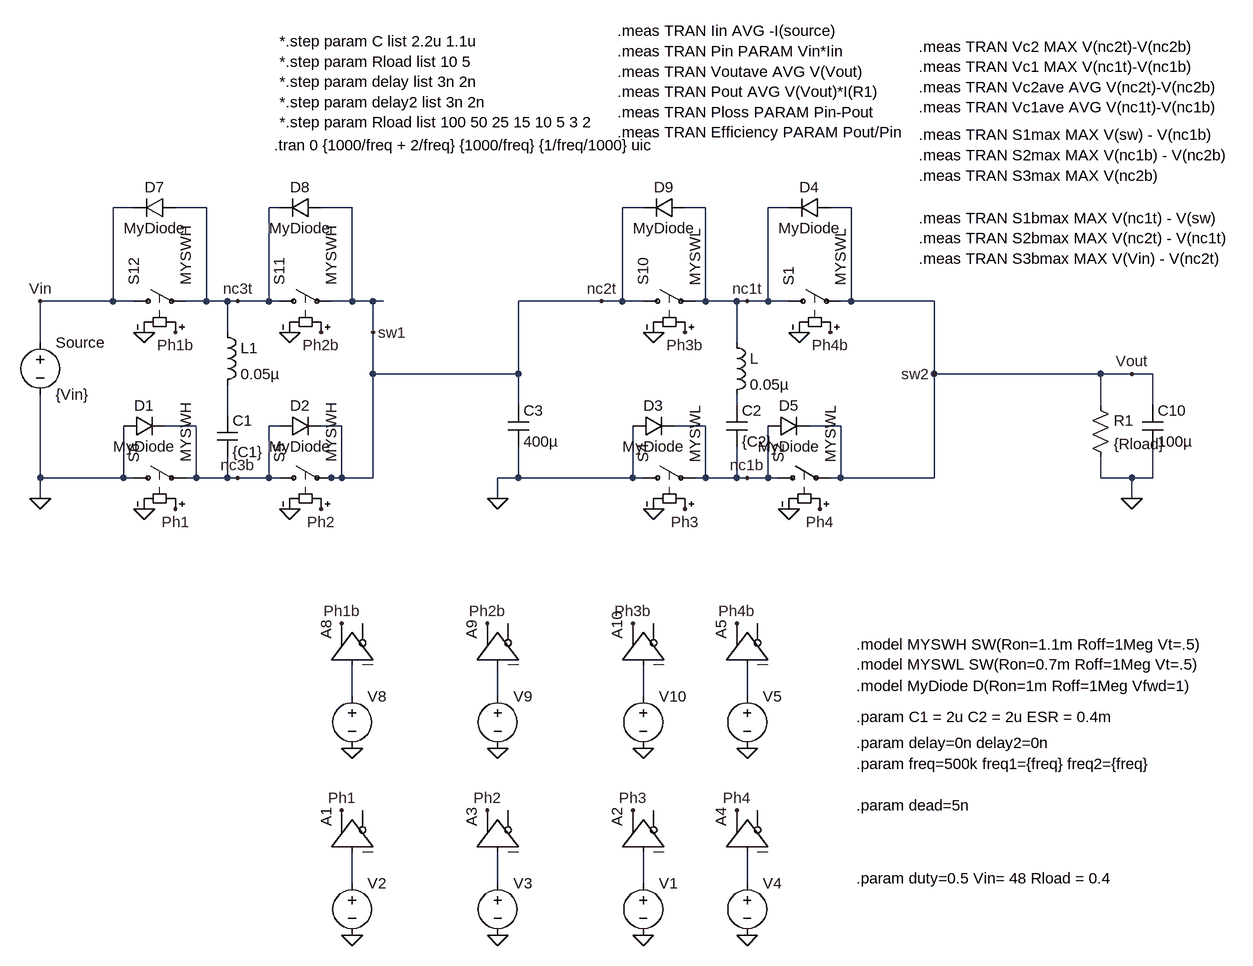
[diagram p0: schematic 3level_squared_48V_distributed_1.asc]
3level_squared_48V_distributed_1.asc, the LTspice schematic file:
Version 4
SHEET 1 1904 1716
WIRE -1472 -64 -1504 -64
WIRE -1360 -64 -1408 -64
WIRE -1248 -64 -1264 -64
WIRE -1136 -64 -1184 -64
WIRE -688 -64 -720 -64
WIRE -592 -64 -624 -64
WIRE -464 -64 -496 -64
WIRE -368 -64 -400 -64
WIRE -1504 80 -1504 -64
WIRE -1504 80 -1616 80
WIRE -1472 80 -1504 80
WIRE -1360 80 -1360 -64
WIRE -1360 80 -1392 80
WIRE -1328 80 -1360 80
WIRE -1312 80 -1328 80
WIRE -1264 80 -1264 -64
WIRE -1264 80 -1312 80
WIRE -1248 80 -1264 80
WIRE -1136 80 -1136 -64
WIRE -1136 80 -1168 80
WIRE -1104 80 -1136 80
WIRE -1088 80 -1104 80
WIRE -752 80 -880 80
WIRE -720 80 -720 -64
WIRE -720 80 -752 80
WIRE -688 80 -720 80
WIRE -592 80 -592 -64
WIRE -592 80 -608 80
WIRE -544 80 -592 80
WIRE -528 80 -544 80
WIRE -496 80 -496 -64
WIRE -496 80 -528 80
WIRE -464 80 -496 80
WIRE -368 80 -368 -64
WIRE -368 80 -384 80
WIRE -240 80 -368 80
WIRE -1328 128 -1328 80
WIRE -1104 128 -1104 80
WIRE -1616 144 -1616 80
WIRE -544 144 -544 80
WIRE -1104 192 -1104 128
WIRE -880 192 -880 80
WIRE -880 192 -1104 192
WIRE -240 192 -240 80
WIRE 16 192 -240 192
WIRE 64 192 16 192
WIRE 96 192 64 192
WIRE -880 240 -880 192
WIRE -544 240 -544 224
WIRE 16 240 16 192
WIRE 96 240 96 192
WIRE -1328 256 -1328 208
WIRE -1376 272 -1424 272
WIRE -1248 272 -1264 272
WIRE -1152 272 -1184 272
WIRE -592 272 -640 272
WIRE -384 272 -432 272
WIRE -1616 352 -1616 224
WIRE -1488 352 -1488 272
WIRE -1488 352 -1616 352
WIRE -1472 352 -1488 352
WIRE -1376 352 -1376 272
WIRE -1376 352 -1392 352
WIRE -1328 352 -1328 320
WIRE -1328 352 -1376 352
WIRE -1312 352 -1328 352
WIRE -1264 352 -1264 272
WIRE -1264 352 -1312 352
WIRE -1248 352 -1264 352
WIRE -1168 352 -1184 352
WIRE -1152 352 -1152 272
WIRE -1152 352 -1168 352
WIRE -1104 352 -1104 192
WIRE -1104 352 -1152 352
WIRE -880 352 -880 304
WIRE -880 352 -912 352
WIRE -704 352 -704 272
WIRE -704 352 -880 352
WIRE -688 352 -704 352
WIRE -592 352 -592 272
WIRE -592 352 -608 352
WIRE -544 352 -544 304
WIRE -544 352 -592 352
WIRE -528 352 -544 352
WIRE -496 352 -496 272
WIRE -496 352 -528 352
WIRE -480 352 -496 352
WIRE -384 352 -384 272
WIRE -384 352 -400 352
WIRE -240 352 -240 192
WIRE -240 352 -384 352
WIRE 16 352 16 320
WIRE 64 352 16 352
WIRE 96 352 96 304
WIRE 96 352 64 352
WIRE -1616 384 -1616 352
WIRE -912 384 -912 352
WIRE 64 384 64 352
WIRE -1136 688 -1136 640
WIRE -912 688 -912 640
WIRE -688 688 -688 640
WIRE -528 688 -528 640
WIRE -1136 976 -1136 928
WIRE -912 976 -912 928
WIRE -688 976 -688 928
WIRE -528 976 -528 928
FLAG -1136 1056 0
FLAG -1152 864 Ph1
FLAG -1616 80 Vin
FLAG -624 128 Ph3b
FLAG -1184 128 Ph2b
FLAG -1408 128 Ph1b
FLAG -1456 128 0
FLAG -1232 128 0
FLAG -672 128 0
FLAG -912 1056 0
FLAG -928 864 Ph2
FLAG -624 400 Ph3
FLAG -1184 400 Ph2
FLAG -1408 400 Ph1
FLAG -1456 400 0
FLAG -1232 400 0
FLAG -672 400 0
FLAG 64 384 0
FLAG -1616 384 0
FLAG -688 1056 0
FLAG -704 864 Ph3
FLAG -1136 768 0
FLAG -1152 576 Ph1b
FLAG -912 768 0
FLAG -928 576 Ph2b
FLAG -688 768 0
FLAG -704 576 Ph3b
FLAG -1312 80 nc3t
FLAG -752 80 nc2t
FLAG -1312 352 nc3b
FLAG -240 192 sw2
FLAG -400 128 Ph4b
FLAG -448 128 0
FLAG -416 400 Ph4
FLAG -464 400 0
FLAG -528 80 nc1t
FLAG -528 352 nc1b
FLAG -528 1056 0
FLAG -544 864 Ph4
FLAG -528 768 0
FLAG -544 576 Ph4b
FLAG 64 192 Vout
FLAG -912 384 0
FLAG -1104 128 sw1
SYMBOL voltage -1136 960 R0
WINDOW 123 0 0 Left 2
WINDOW 39 0 0 Left 2
WINDOW 3 24 96 Invisible 2
SYMATTR Value PULSE(0 1 0 1p 1p {1/freq1*(1-duty)} {1/freq1})
SYMATTR InstName V2
SYMBOL Digital\\buf -1200 928 R270
SYMATTR InstName A1
SYMBOL voltage -1616 128 R0
WINDOW 123 0 0 Left 2
WINDOW 39 0 0 Left 2
SYMATTR InstName Source
SYMATTR Value {Vin}
SYMBOL sw -704 80 R270
SYMATTR InstName S10
SYMATTR Value MYSWL
SYMBOL sw -1264 80 R270
SYMATTR InstName S11
SYMATTR Value MYSWH
SYMBOL sw -1488 80 R270
SYMATTR InstName S12
SYMATTR Value MYSWH
SYMBOL voltage -912 960 R0
WINDOW 123 0 0 Left 2
WINDOW 39 0 0 Left 2
WINDOW 3 24 96 Invisible 2
SYMATTR Value PULSE(0 1 {1/freq1/2+delay} 1p 1p {1/freq1*(1-duty)-delay+delay2} {1/freq1})
SYMATTR InstName V3
SYMBOL Digital\\buf -976 928 R270
SYMATTR InstName A3
SYMBOL sw -704 352 R270
SYMATTR InstName S4
SYMATTR Value MYSWL
SYMBOL sw -1264 352 R270
SYMATTR InstName S5
SYMATTR Value MYSWH
SYMBOL sw -1488 352 R270
SYMATTR InstName S6
SYMATTR Value MYSWH
SYMBOL cap -1344 256 R0
SYMATTR InstName C1
SYMATTR Value {C1}
SYMATTR SpiceLine Rser={ESR}
SYMATTR SpiceLine2 IC={Vin/2}
SYMBOL ind -560 128 R0
SYMATTR InstName L
SYMATTR Value 0.05µ
SYMATTR SpiceLine Rser=0.2m Rpar=1k
SYMATTR SpiceLine2 ic = {Vin*duty/Rload}
SYMBOL res 0 224 R0
SYMATTR InstName R1
SYMATTR Value {Rload}
SYMBOL cap 80 240 R0
SYMATTR InstName C10
SYMATTR Value 100µ
SYMATTR SpiceLine IC={Vin*duty}
SYMATTR SpiceLine2 Rser={ESR}
SYMBOL voltage -688 960 R0
WINDOW 123 0 0 Left 2
WINDOW 39 0 0 Left 2
WINDOW 3 24 96 Invisible 2
SYMATTR Value PULSE(0 1 0 1p 1p {1/freq2*(1-duty)} {1/freq2})
SYMATTR InstName V1
SYMBOL Digital\\buf -752 928 R270
SYMATTR InstName A2
SYMBOL voltage -1136 672 R0
WINDOW 123 0 0 Left 2
WINDOW 39 0 0 Left 2
WINDOW 3 24 96 Invisible 2
SYMATTR Value PULSE(0 1 {1/freq1*(1-duty)+dead+delay} 1p 1p {1/freq1*duty-dead*2-delay+delay2} {1/freq1})
SYMATTR InstName V8
SYMBOL Digital\\buf -1200 640 R270
SYMATTR InstName A8
SYMBOL voltage -912 672 R0
WINDOW 123 0 0 Left 2
WINDOW 39 0 0 Left 2
WINDOW 3 24 96 Invisible 2
SYMATTR Value PULSE(0 1 {1/freq1/2+1/freq1*(1-duty)+dead} 1p 1p {1/freq1*duty-dead*2} {1/freq1})
SYMATTR InstName V9
SYMBOL Digital\\buf -976 640 R270
SYMATTR InstName A9
SYMBOL voltage -688 672 R0
WINDOW 123 0 0 Left 2
WINDOW 39 0 0 Left 2
WINDOW 3 24 44 Invisible 2
SYMATTR Value PULSE(0 1 {1/freq2*(1-duty)+dead+delay} 1p 1p {1/freq2*duty-dead*2-delay+delay2} {1/freq2})
SYMATTR InstName V10
SYMBOL Digital\\buf -752 640 R270
SYMATTR InstName A10
SYMBOL diode -1488 288 R270
WINDOW 0 32 32 VTop 2
WINDOW 3 0 32 VBottom 2
SYMATTR InstName D1
SYMATTR Value MyDiode
SYMBOL diode -1248 288 R270
WINDOW 0 32 32 VTop 2
WINDOW 3 0 32 VBottom 2
SYMATTR InstName D2
SYMATTR Value MyDiode
SYMBOL diode -704 288 R270
WINDOW 0 32 32 VTop 2
WINDOW 3 0 32 VBottom 2
SYMATTR InstName D3
SYMATTR Value MyDiode
SYMBOL diode -1408 -80 R90
WINDOW 0 0 32 VBottom 2
WINDOW 3 32 32 VTop 2
SYMATTR InstName D7
SYMATTR Value MyDiode
SYMBOL diode -1184 -80 R90
WINDOW 0 0 32 VBottom 2
WINDOW 3 32 32 VTop 2
SYMATTR InstName D8
SYMATTR Value MyDiode
SYMBOL diode -624 -80 R90
WINDOW 0 0 32 VBottom 2
WINDOW 3 32 32 VTop 2
SYMATTR InstName D9
SYMATTR Value MyDiode
SYMBOL sw -480 80 R270
SYMATTR InstName S1
SYMATTR Value MYSWL
SYMBOL diode -400 -80 R90
WINDOW 0 0 32 VBottom 2
WINDOW 3 32 32 VTop 2
SYMATTR InstName D4
SYMATTR Value MyDiode
SYMBOL sw -496 352 R270
SYMATTR InstName S2
SYMATTR Value MYSWL
SYMBOL diode -496 288 R270
WINDOW 0 32 32 VTop 2
WINDOW 3 0 32 VBottom 2
SYMATTR InstName D5
SYMATTR Value MyDiode
SYMBOL cap -560 240 R0
SYMATTR InstName C2
SYMATTR Value {C2}
SYMATTR SpiceLine Rser={ESR}
SYMATTR SpiceLine2 IC={Vin/4}
SYMBOL voltage -528 960 R0
WINDOW 123 0 0 Left 2
WINDOW 39 0 0 Left 2
WINDOW 3 24 96 Invisible 2
SYMATTR Value PULSE(0 1 {1/freq2/2} 1p 1p {1/freq2*(1-duty)} {1/freq2})
SYMATTR InstName V4
SYMBOL Digital\\buf -592 928 R270
SYMATTR InstName A4
SYMBOL voltage -528 672 R0
WINDOW 123 0 0 Left 2
WINDOW 39 0 0 Left 2
WINDOW 3 24 44 Invisible 2
SYMATTR Value PULSE(0 1 {1/freq2/2+1/freq2*(1-duty)+dead+delay} 1p 1p {1/freq2*duty-dead*2-delay+delay2} {1/freq2})
SYMATTR InstName V5
SYMBOL Digital\\buf -592 640 R270
SYMATTR InstName A5
SYMBOL ind -1344 112 R0
SYMATTR InstName L1
SYMATTR Value 0.05µ
SYMATTR SpiceLine Rser=0.2m Rpar=1k
SYMATTR SpiceLine2 ic = {Vin*duty/Rload}
SYMBOL cap -896 240 R0
SYMATTR InstName C3
SYMATTR Value 400µ
SYMATTR SpiceLine IC={Vin/2}
SYMATTR SpiceLine2 Rser={ESR}
TEXT -1256 -160 Left 2 !.tran 0 {1000/freq + 2/freq} {1000/freq} {1/freq/1000} uic
TEXT -360 608 Left 2 !.model MYSWH SW(Ron=1.1m Roff=1Meg Vt=.5)\n.model MYSWL SW(Ron=0.7m Roff=1Meg Vt=.5)
TEXT -360 672 Left 2 !.model MyDiode D(Ron=1m Roff=1Meg Vfwd=1)
TEXT -360 760 Left 2 !.param delay=0n delay2=0n
TEXT -360 792 Left 2 !.param freq=500k freq1={freq} freq2={freq}
TEXT -360 968 Left 2 !.param duty=0.5 Vin= 48 Rload = 0.4
TEXT -360 856 Left 2 !.param dead=5n
TEXT -360 720 Left 2 !.param C1 = 2u C2 = 2u ESR = 0.4m
TEXT -264 -176 Left 2 !.meas TRAN S1max MAX V(sw) - V(nc1b)\n.meas TRAN S2max MAX V(nc1b) - V(nc2b)\n.meas TRAN S3max MAX V(nc2b)
TEXT -264 -312 Left 2 !.meas TRAN Vc2 MAX V(nc2t)-V(nc2b)\n.meas TRAN Vc1 MAX V(nc1t)-V(nc1b)\n.meas TRAN Vc2ave AVG V(nc2t)-V(nc2b)\n.meas TRAN Vc1ave AVG V(nc1t)-V(nc1b)
TEXT -264 -48 Left 2 !.meas TRAN S1bmax MAX V(nc1t) - V(sw) \n.meas TRAN S2bmax MAX V(nc2t) - V(nc1t) \n.meas TRAN S3bmax MAX V(Vin) - V(nc2t)
TEXT -1248 -320 Left 2 !*.step param C list 2.2u 1.1u\n*.step param Rload list 10 5\n*.step param delay list 3n 2n\n*.step param delay2 list 3n 2n\n*.step param Rload list 100 50 25 15 10 5 3 2
TEXT -728 -336 Left 2 !.meas TRAN Iin AVG -I(source)\n.meas TRAN Pin PARAM Vin*Iin\n.meas TRAN Voutave AVG V(Vout)\n.meas TRAN Pout AVG V(Vout)*I(R1)\n.meas TRAN Ploss PARAM Pin-Pout\n.meas TRAN Efficiency PARAM Pout/Pin

The netlist it stands for:
* 3level_squared_48V_distributed_1.asc
V2 N007 0 PULSE(0 1 0 1p 1p {1/freq1*(1-duty)} {1/freq1})
A1 N007 0 0 0 0 0 Ph1 0 BUF
V§Source Vin 0 {Vin}
S10 sw1 nc1t Ph3b 0 MYSWL
S11 nc3t sw1 Ph2b 0 MYSWH
S12 Vin nc3t Ph1b 0 MYSWH
V3 N008 0 PULSE(0 1 {1/freq1/2+delay} 1p 1p {1/freq1*(1-duty)-delay+delay2} {1/freq1})
A3 N008 0 0 0 0 0 Ph2 0 BUF
S4 0 nc1b Ph3 0 MYSWL
S5 nc3b sw1 Ph2 0 MYSWH
S6 0 nc3b Ph1 0 MYSWH
C1 N002 nc3b {C1} Rser={ESR} IC={Vin/2}
L nc1t N001 0.05µ Rser=0.2m Rpar=1k ic = {Vin*duty/Rload}
R1 Vout 0 {Rload}
C10 Vout 0 100µ IC={Vin*duty} Rser={ESR}
V1 N009 0 PULSE(0 1 0 1p 1p {1/freq2*(1-duty)} {1/freq2})
A2 N009 0 0 0 0 0 Ph3 0 BUF
V8 N003 0 PULSE(0 1 {1/freq1*(1-duty)+dead+delay} 1p 1p {1/freq1*duty-dead*2-delay+delay2} {1/freq1})
A8 N003 0 0 0 0 0 Ph1b 0 BUF
V9 N004 0 PULSE(0 1 {1/freq1/2+1/freq1*(1-duty)+dead} 1p 1p {1/freq1*duty-dead*2} {1/freq1})
A9 N004 0 0 0 0 0 Ph2b 0 BUF
V10 N005 0 PULSE(0 1 {1/freq2*(1-duty)+dead+delay} 1p 1p {1/freq2*duty-dead*2-delay+delay2} {1/freq2})
A10 N005 0 0 0 0 0 Ph3b 0 BUF
D1 0 nc3b MyDiode
D2 nc3b sw1 MyDiode
D3 0 nc1b MyDiode
D7 nc3t Vin MyDiode
D8 sw1 nc3t MyDiode
D9 nc1t sw1 MyDiode
S1 nc1t Vout Ph4b 0 MYSWL
D4 Vout nc1t MyDiode
S2 nc1b Vout Ph4 0 MYSWL
D5 nc1b Vout MyDiode
C2 N001 nc1b {C2} Rser={ESR} IC={Vin/4}
V4 N010 0 PULSE(0 1 {1/freq2/2} 1p 1p {1/freq2*(1-duty)} {1/freq2})
A4 N010 0 0 0 0 0 Ph4 0 BUF
V5 N006 0 PULSE(0 1 {1/freq2/2+1/freq2*(1-duty)+dead+delay} 1p 1p {1/freq2*duty-dead*2-delay+delay2} {1/freq2})
A5 N006 0 0 0 0 0 Ph4b 0 BUF
L1 nc3t N002 0.05µ Rser=0.2m Rpar=1k ic = {Vin*duty/Rload}
C3 sw1 0 400µ IC={Vin/2} Rser={ESR}
.model D D
.lib standard.dio
.tran 0 {1000/freq + 2/freq} {1000/freq} {1/freq/1000} uic
.model MYSWH SW(Ron=1.1m Roff=1Meg Vt=.5)
.model MYSWL SW(Ron=0.7m Roff=1Meg Vt=.5)
.model MyDiode D(Ron=1m Roff=1Meg Vfwd=1)
.param delay=0n delay2=0n
.param freq=500k freq1={freq} freq2={freq}
.param duty=0.5 Vin= 48 Rload = 0.4
.param dead=5n
.param C1 = 2u C2 = 2u ESR = 0.4m
.meas TRAN S1max MAX V(sw) - V(nc1b)
.meas TRAN S2max MAX V(nc1b) - V(nc2b)
.meas TRAN S3max MAX V(nc2b)
.meas TRAN Vc2 MAX V(nc2t)-V(nc2b)
.meas TRAN Vc1 MAX V(nc1t)-V(nc1b)
.meas TRAN Vc2ave AVG V(nc2t)-V(nc2b)
.meas TRAN Vc1ave AVG V(nc1t)-V(nc1b)
.meas TRAN S1bmax MAX V(nc1t) - V(sw)
.meas TRAN S2bmax MAX V(nc2t) - V(nc1t)
.meas TRAN S3bmax MAX V(Vin) - V(nc2t)
*.step param C list 2.2u 1.1u
*.step param Rload list 10 5
*.step param delay list 3n 2n
*.step param delay2 list 3n 2n
*.step param Rload list 100 50 25 15 10 5 3 2
.meas TRAN Iin AVG -I(source)
.meas TRAN Pin PARAM Vin*Iin
.meas TRAN Voutave AVG V(Vout)
.meas TRAN Pout AVG V(Vout)*I(R1)
.meas TRAN Ploss PARAM Pin-Pout
.meas TRAN Efficiency PARAM Pout/Pin
.backanno
.end